# Altium schematic sheet Barun Gas Control.SchDoc
size A3
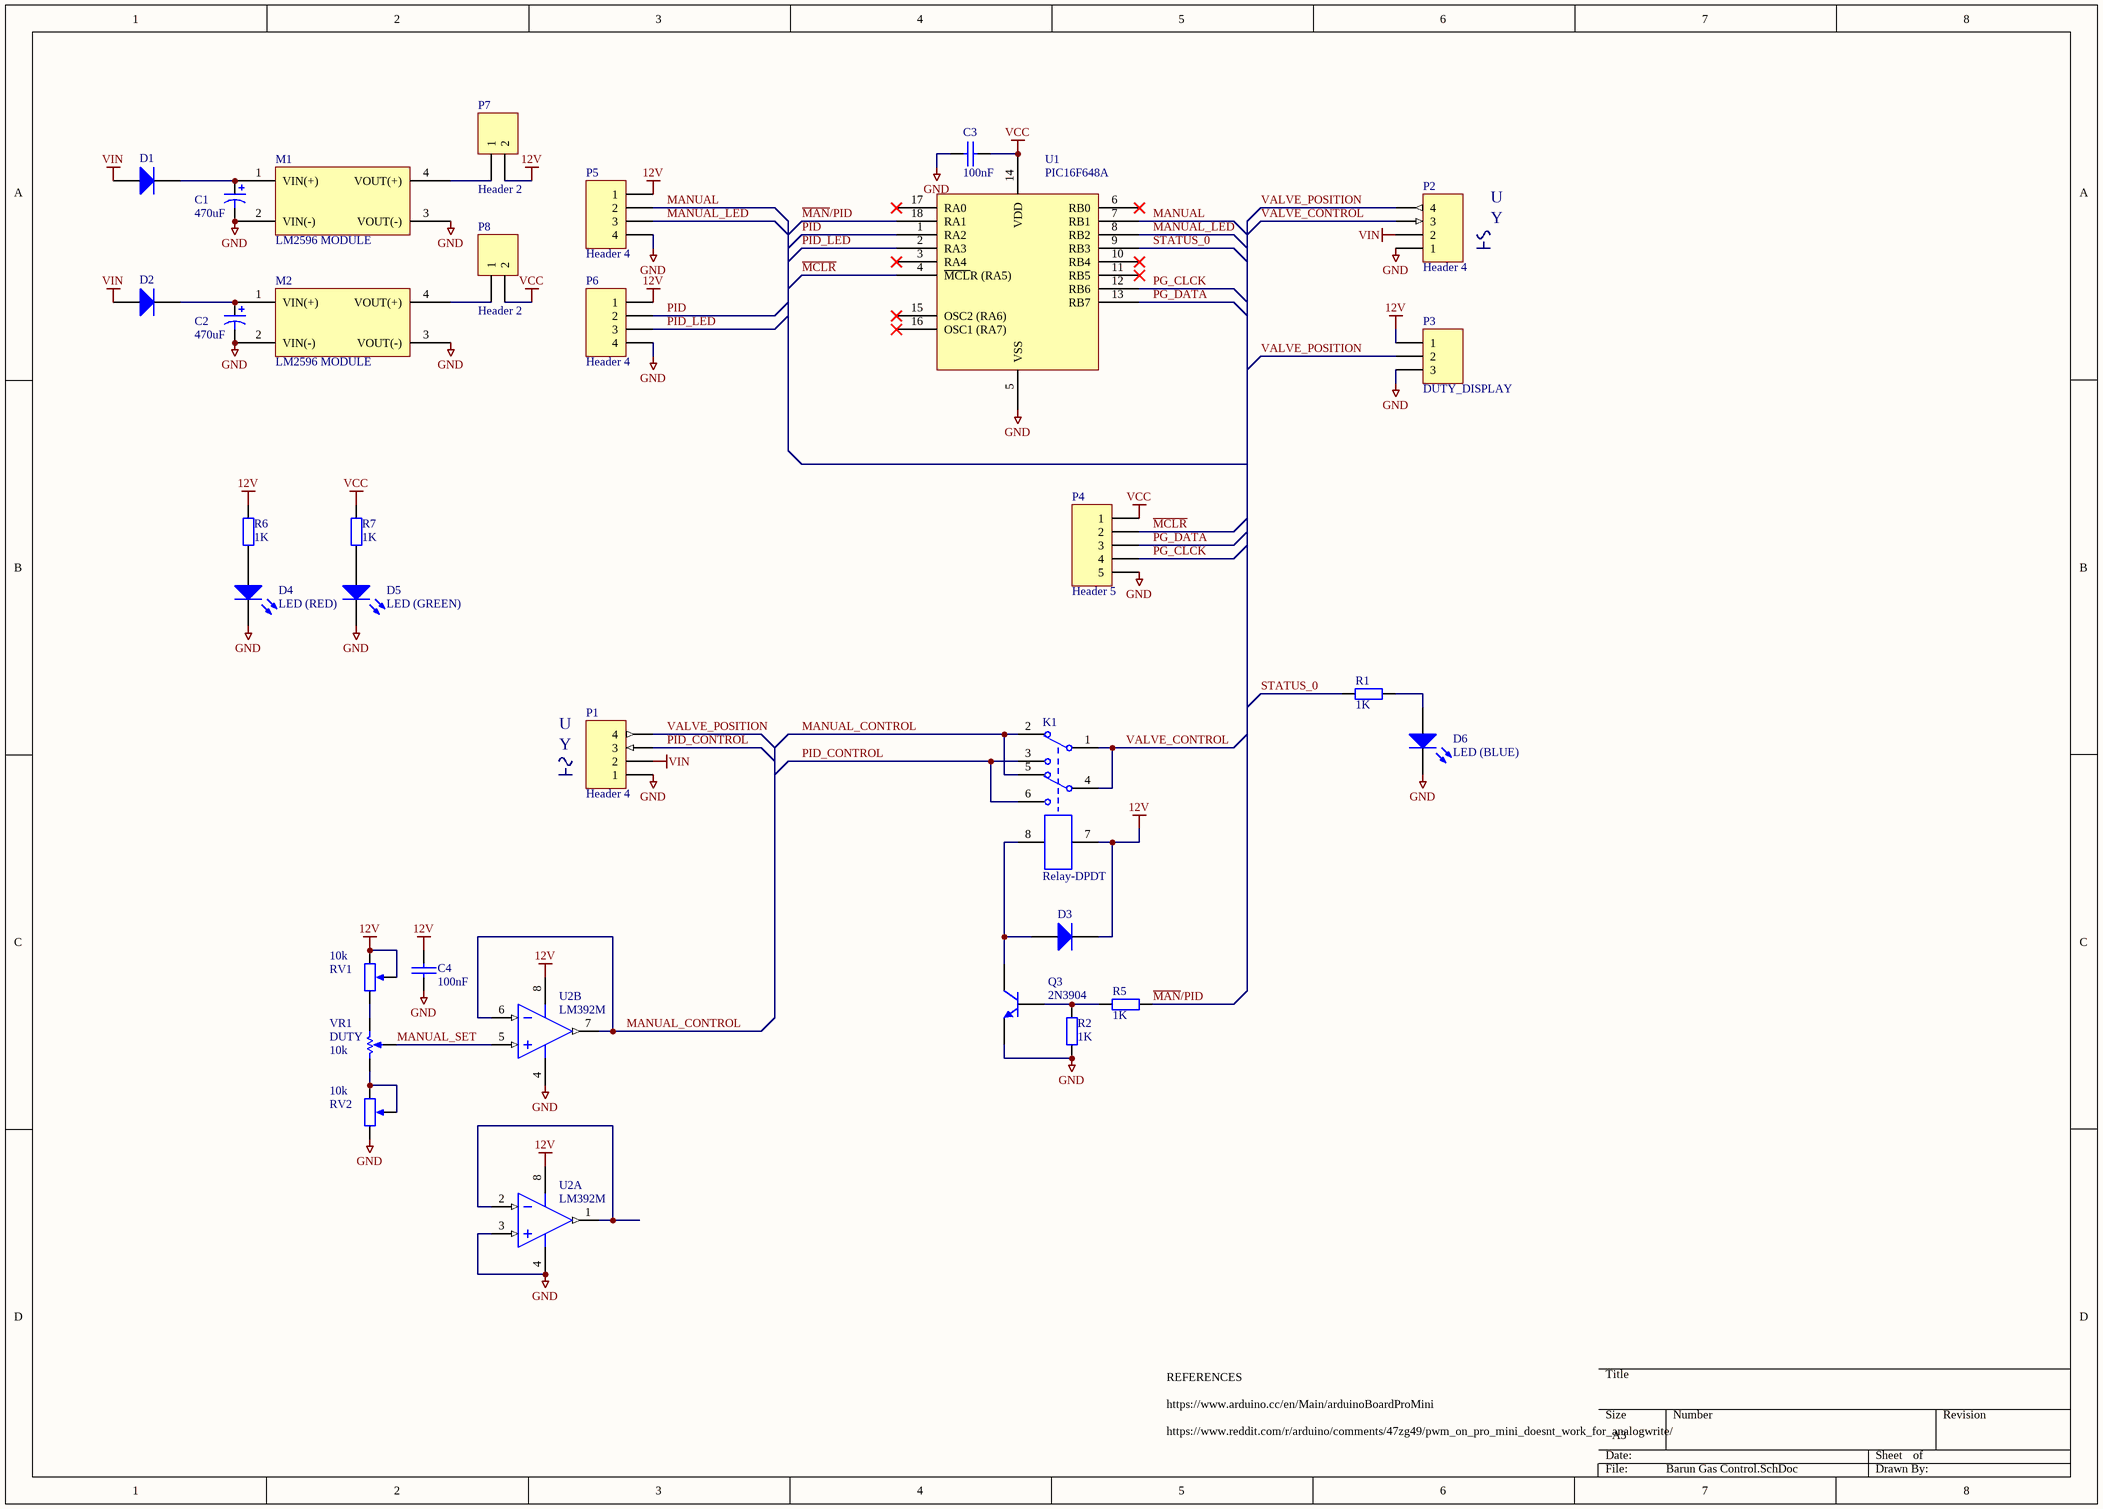
[diagram p0: Barun Gas Control.SchDoc]

## Parts
C1  value 470uF  [RB7.6-15]  (hidden comment: Cap Pol3)
C2  value 470uF  [RB7.6-15]  (hidden comment: Cap Pol3)
C3  100nF  [CAP RADIAL 0.200]
C4  100nF  [CAP RADIAL 0.200]
D1  Diode 1N4148  [DO-35]  (value not drawn)
D2  Diode 1N4148  [DO-35]  (value not drawn)
D3  Diode 1N4148  [DO-35]  (value not drawn)
D4  LED (RED)  [LED(3D) 5MM VERTICAL (GREEN)]
D5  LED (GREEN)  [LED(3D) 5MM VERTICAL (GREEN)]
D6  LED (BLUE)  [LED(3D) 5MM VERTICAL (GREEN)]
K1  Relay-DPDT  [RELAY DPDT]
M1  LM2596 MODULE  [LM2596 Module]
M2  LM2596 MODULE  [LM2596 Module]
P1  Header 4  [5.08mm HEADER 4 Way - With Socket]
P2  Header 4  [5.08mm HEADER 4 Way - With Socket]
P3  DUTY_DISPLAY  [HDR1X3]
P4  Header 5  [HDR1X5]
P5  Header 4  [HDR1X4]
P6  Header 4  [HDR1X4]
P7  Header 2  [HDR1X2]
P8  Header 2  [HDR1X2]
Q3  2N3904  [TO-92A]
R1  value 1K  [AXIAL-0.4]  (hidden comment: Res2)
R2  value 1K  [AXIAL-0.4]  (hidden comment: Res2)
R5  value 1K  [AXIAL-0.4]  (hidden comment: Res2)
R6  value 1K  [AXIAL-0.4]  (hidden comment: Res2)
R7  value 1K  [AXIAL-0.4]  (hidden comment: Res2)
RV1  10k  [TRIMMER]
RV2  10k  [TRIMMER]
U1  PIC16F648A  [DIP-18]
U2  LM392M  [DIP_8]  (parts A,B of 2)
VR1  DUTY  value 10k  [HDR1X3]

## Nets
12V: C4.2 D3.2(K) K1.7 P3.1 P5.1 P6.1 P7.2 R6.1 RV1.1 RV1.2 U2.8(V+)
GND: C1.2 C2.2 C3.1 C4.1 D4.2(K) D5.2(K) D6.2(K) M1.2(VIN(-)) M1.3(VOUT(-)) M2.2(VIN(-)) M2.3(VOUT(-)) P1.1 P2.1 P3.3 P4.5 P5.4 P6.4 Q3.1(E) R2.1 RV2.3 U1.5(VSS) U2.3(INA+) U2.4(GND)
VCC: C3.2 P4.1 P8.2 R7.1 U1.14(VDD)
VIN: D1.1(A) D2.1(A) P1.2 P2.2
~{MCLR}: P4.2 U1.4(~{MCL}R_(RA5))
~{MAN}/PID: R5.1 U1.18(RA1)
MANUAL: P5.2 U1.7(RB1)
MANUAL_CONTROL: K1.2 K1.5 U2.6(INB-) U2.7(OUTB)
MANUAL_LED: P5.3 U1.8(RB2)
MANUAL_SET: U2.5(INB+) VR1.3(TAP)
PG_CLCK: P4.4 U1.12(RB6)
PG_DATA: P4.3 U1.13(RB7)
PID: P6.2 U1.1(RA2)
PID_CONTROL: K1.3 K1.6 P1.3
PID_LED: P6.3 U1.2(RA3)
STATUS_0: R1.2 U1.9(RB3)
VALVE_CONTROL: K1.1 K1.4 P2.3
VALVE_POSITION: P1.4 P2.4 P3.2
NetC1_1: C1.1 D1.2(K) M1.1(VIN(+))
NetC2_1: C2.1 D2.2(K) M2.1(VIN(+))
NetD3_1: D3.1(A) K1.8 Q3.3(C)
NetD4_1: D4.1(A) R6.2
NetD5_1: D5.1(A) R7.2
NetD6_1: D6.1(A) R1.1
NetM1_4: M1.4(VOUT(+)) P7.1
NetM2_4: M2.4(VOUT(+)) P8.1
NetQ3_2: Q3.2(B) R2.2 R5.2
NetRV1_3: RV1.3 VR1.1(TOP)
NetRV2_1: RV2.1 RV2.2 VR1.2(BOT)
NetU2_1: U2.1(OUTA) U2.2(INA-)

Not connected (* = marked no-connect by the designer): U1 3(RA4)* 6(RB0)* 10(RB4)* 11(RB5)* 15(OSC2_(RA6))* 16(OSC1_(RA7))* 17(RA0)*

## Notes on the sheet
- Y
- U
- REFERENCES
  https://www.arduino.cc/en/Main/arduinoBoardProMini
  https://www.reddit.com/r/arduino/comments/47zg49/pwm_on_pro_mini_doesnt_work_for_analogwrite/

## Library data of the parts
C1 C2 = Cap Pol3: Polarized Capacitor (Surface Mount); Published: 8-Jun-2000; LatestRevisionDate: 29-May-2009; LatestRevisionNote: IPC-7351 Footprint Added.; PackageReference: C0805; Publisher: Altium Limited; PackageDescription: Chip Capacitor
C3 C4 = CAP: CAPACITOR SMD 0402; value: 100nF; Supplier 1: Mouser; Supplier Part Number 1: 810-CGJ3E2X7R1H104K
D1-D3 = Diode 1N4148: High Conductance Fast Diode; Published: 8-Jun-2000; LatestRevisionDate: 17-Jul-2002; LatestRevisionNote: Re-released for DXP Platform.; DatasheetVersion: 1997; PackageReference: DO-35; Publisher: Altium Limited; PackageDescription: Diode, Axial; Body 3.8 x 1.9 mm (LxDia. max), Lead Dia. 0.53 mm (max); Code_JEDEC: DO-204-AH; ComponentLink1Description: Manufacturer Link; ComponentLink1URL: http://www.fairchildsemi.com/; ComponentLink2Description: Datasheet; ComponentLink2URL: http://www.fairchildsemi.com/ds/1N%2F1N4148.pdf
D4-D6 = LED 3mm RED: 3mm RED LED; Manufacturer: Kingbright; Manufacturer Part No.: WP132XIT; Mouser Part no.: 604-WP132XIT; Farnell Part no.: 1003393; Web link: http://au.mouser.com/Search/Refine.aspx?Keyword=604-WP132XIT
K1 = Relay-DPDT: Altronics S4136 12V Coil; Manufacturer: Generic Components; Manufacturer: Ningbo Forward Relay Corporation LTD; Manufacturer Part No.: PS-12; Revision: July-2002: Re-released for DXP Platform.; Web Link: http://www.forward-relays.com/doce/products/product_detail.asp?catalogid=&productid=93
P1 P2 = Header 4: Header, 4-Pin; Manufacturer: Phoenix Contact; Manufacturer Part No.: 1733596; value: 4 x 5.08mm; Mouser Part no.: 651-1733596; Web link: http://au.mouser.com/ProductDetail/Phoenix-Contact/1733596/?qs=8BCRtFWWXOQoaU9FOMDU4Q%3d%3d
P3 = Header 3: Header, 3-Pin; LatestRevisionDate: 17-Jul-2002; LatestRevisionNote: Re-released for DXP Platform.; Publisher: Altium Limited
P4 = Header 5: Header, 5-Pin; LatestRevisionDate: 17-Jul-2002; LatestRevisionNote: Re-released for DXP Platform.; Publisher: Altium Limited
P5 P6 = Header 4: Header, 4-Pin; LatestRevisionDate: 17-Jul-2002; LatestRevisionNote: Re-released for DXP Platform.; Publisher: Altium Limited
P7 P8 = Header 2: Header, 2-Pin; LatestRevisionDate: 17-Jul-2002; LatestRevisionNote: Re-released for DXP Platform.; Publisher: Altium Limited
Q3 = 2N3904: NPN General Purpose Amplifier; Published: 8-Jun-2000; LatestRevisionDate: 15-Jan-2003; LatestRevisionNote: PCB Footprint 'BCY-W3/D4.7' replaced; DatasheetVersion: 1997; PackageVersion: Sep-1998; PackageReference: TO-92A; Publisher: Altium Limited; PackageDescription: TO, Flat Index; 3 In-Line, Axial Leads; Body Dia. 4.5mm; Leads 0.51 x 0.48 mm (max); ComponentLink1Description: Manufacturer Link; ComponentLink1URL: http://www.fairchildsemi.com/; ComponentLink2Description: Datasheet; ComponentLink2URL: http://www.fairchildsemi.com/ds/2N%2F2N3904.pdf
R1 R2 R5-R7 = Res2: Resistor; Published: 8-Jun-2000; LatestRevisionDate: 17-Jul-2002; LatestRevisionNote: Re-released for DXP Platform.; PackageReference: AXIAL-0.4; Publisher: Altium Limited; PackageDescription: Axial Device, Thru-Hole; 2 Leads; 0.4 in Pin Spacing
RV1 RV2 = VAR (POT) SMD: Variable Resistor; Series: PVZ3A; Value: 10k
U1 = PIC16F87/88: PIC16F88; Manufacturer: Microchip Technology; Manufacturer Part No.: PIC16F88-E/SS; Mouser Part no.: 579-PIC16F88-E/SS; Farnell Part no.: 9761519; value: PIC16F88; Web link: http://au.mouser.com/ProductDetail/Microchip-Technology/PIC16F88-E-SS/?qs=sGAEpiMZZMvu0Nwh4cA1waDrdroEY0RCb%252bRi%252b4Dz0K0%3d
U2 = LM392M: Low Power Operational Amplifier/Voltage Comparator, 8-pin Narrow SOIC; Manufacturer: National Semiconductor; PackageTopMarking: NSZXTT*LM392*M; PowerWise: N; CompType: Amplifiers; Published: 4-Dec-2008; LatestRevisionDate: 13-Jan-2009; LatestRevisionNote: Sim Model Added.; DatasheetVersion: Aug-2000; PackageVersion: revM, May-2009; PackageReference: M08A; Publisher: Altium Limited; PackageDescription: SOIC Narrow, 4.9 x 3.9 x 1.45mm, 8 Lead, 1.27mm Pitch; Supplier 1: Digi-Key; Supplier Part Number 1: LM392M-ND; Supplier 2: Farnell; Supplier Part Number 2: 9486755; PartNumber: LM392M; RoHS: N; PinCount: 8; Code_JEDEC: MS-012-AA; Code_IPC: SOIC127P600-8; ComponentLink1Description: LM392 Datasheet; ComponentLink1URL: http://www.national.com/ds/LM/LM392.pdf; ComponentLink2Description: LM392 Web Page; ComponentLink2URL: http://www.national.com/pf/LM/LM392.html; ComponentLink3Description: M08A Package Page; ComponentLink3URL: http://www.national.com/packaging/folders/m08a.html
VR1 = RPot: Potentiometer; pin to pad: 2>3 3>2; Sim Note: Enter the Resistance value and the set point into parameter fields.; Set Position: 0.5; Published: 8-Jun-2000; LatestRevisionDate: 17-Jul-2002; LatestRevisionNote: Re-released for DXP Platform.; PackageReference: VR5; Publisher: Altium Limited; PackageDescription: Variable Resistor, Thru-Hole; 3 Leads